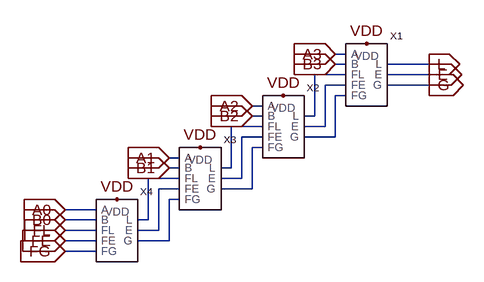
[diagram p0: schematic full-comparator4.asc]
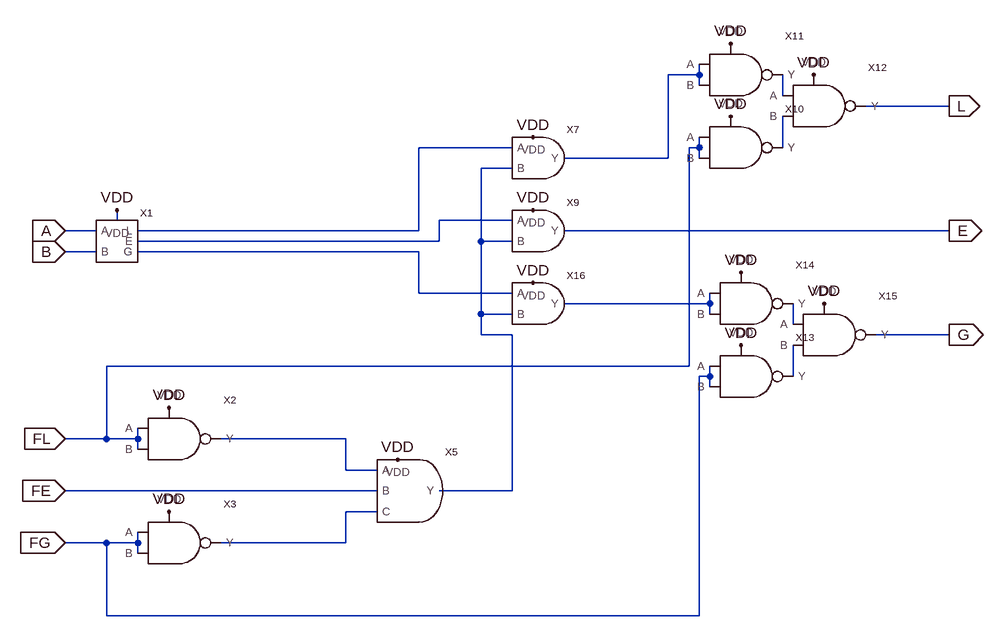
[diagram p1: sub-circuit full-comparator-sequential.asc]
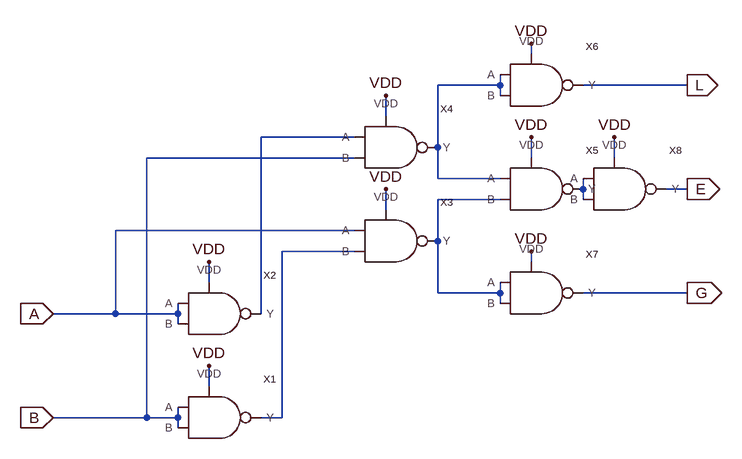
[diagram p2: sub-circuit full-comparator1.asc]
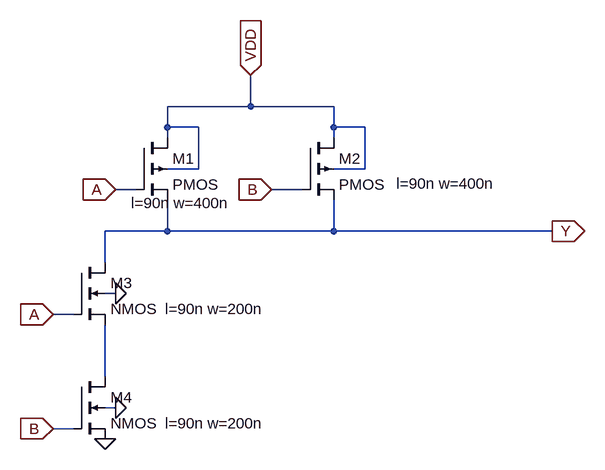
[diagram p3: sub-circuit nand.asc]
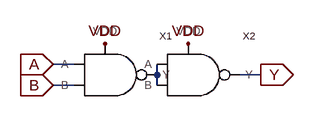
[diagram p4: sub-circuit and.asc]
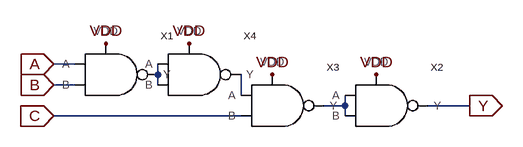
[diagram p5: sub-circuit and3.asc]
full-comparator4.asc, the LTspice schematic file:
Version 4
SHEET 1 1892 1292
WIRE 112 448 96 448
WIRE 112 464 96 464
WIRE 240 464 176 464
WIRE 112 480 64 480
WIRE 240 480 176 480
WIRE 112 496 80 496
WIRE 240 496 176 496
WIRE 112 512 96 512
WIRE -16 528 -32 528
WIRE -16 544 -32 544
WIRE 64 544 64 480
WIRE 64 544 48 544
WIRE -16 560 -64 560
WIRE 80 560 80 496
WIRE 80 560 48 560
WIRE -16 576 -48 576
WIRE 96 576 96 512
WIRE 96 576 48 576
WIRE -16 592 -32 592
WIRE -144 608 -160 608
WIRE -144 624 -160 624
WIRE -64 624 -64 560
WIRE -64 624 -80 624
WIRE -144 640 -192 640
WIRE -48 640 -48 576
WIRE -48 640 -80 640
WIRE -144 656 -176 656
WIRE -32 656 -32 592
WIRE -32 656 -80 656
WIRE -144 672 -160 672
WIRE -272 688 -320 688
WIRE -272 704 -320 704
WIRE -192 704 -192 640
WIRE -192 704 -208 704
WIRE -272 720 -320 720
WIRE -176 720 -176 656
WIRE -176 720 -208 720
WIRE -272 736 -320 736
WIRE -160 736 -160 672
WIRE -160 736 -208 736
WIRE -272 752 -320 752
FLAG -320 688 A0
IOPIN -320 688 In
FLAG -320 704 B0
IOPIN -320 704 In
FLAG -320 720 FL
IOPIN -320 720 In
FLAG -320 736 FE
IOPIN -320 736 In
FLAG -320 752 FG
IOPIN -320 752 In
FLAG -240 672 VDD
FLAG -112 592 VDD
FLAG 16 512 VDD
FLAG 144 432 VDD
FLAG 240 464 L
IOPIN 240 464 Out
FLAG 240 480 E
IOPIN 240 480 Out
FLAG 240 496 G
IOPIN 240 496 Out
FLAG -160 608 A1
IOPIN -160 608 In
FLAG -160 624 B1
IOPIN -160 624 In
FLAG -32 528 A2
IOPIN -32 528 In
FLAG -32 544 B2
IOPIN -32 544 In
FLAG 96 448 A3
IOPIN 96 448 In
FLAG 96 464 B3
IOPIN 96 464 In
SYMBOL full-comparator-sequential 144 480 R0
SYMATTR InstName X1
SYMBOL full-comparator-sequential 16 560 R0
SYMATTR InstName X2
SYMBOL full-comparator-sequential -112 640 R0
SYMATTR InstName X3
SYMBOL full-comparator-sequential -240 720 R0
SYMATTR InstName X4

full-comparator-sequential.asc, the sub-circuit schematic file:
Version 4
SHEET 1 880 680
WIRE 176 -176 176 -192
WIRE 176 -176 128 -176
WIRE 176 -160 176 -176
WIRE 304 -144 304 -176
WIRE 560 -128 432 -128
WIRE -112 -64 -256 -64
WIRE 176 -64 176 -80
WIRE 176 -64 160 -64
WIRE 304 -64 304 -112
WIRE 128 -48 128 -176
WIRE 128 -48 -32 -48
WIRE 176 -48 176 -64
WIRE -112 -32 -160 -32
WIRE -720 48 -720 32
WIRE -112 48 -224 48
WIRE -752 64 -800 64
WIRE -256 64 -256 -64
WIRE -256 64 -688 64
WIRE 560 64 -32 64
WIRE -224 80 -224 48
WIRE -224 80 -688 80
WIRE -160 80 -160 -32
WIRE -112 80 -160 80
WIRE -752 96 -800 96
WIRE -256 96 -688 96
WIRE -256 160 -256 96
WIRE -112 160 -256 160
WIRE 192 176 192 160
WIRE 192 176 -32 176
WIRE -160 192 -160 80
WIRE -112 192 -160 192
WIRE 192 192 192 176
WIRE 320 208 320 176
WIRE -160 224 -160 192
WIRE -112 224 -160 224
WIRE 560 224 448 224
WIRE 160 272 160 -64
WIRE 160 272 -736 272
WIRE 192 288 192 272
WIRE 192 288 176 288
WIRE 320 288 320 240
WIRE 192 304 192 288
WIRE -736 384 -736 272
WIRE -736 384 -800 384
WIRE -688 384 -688 368
WIRE -688 384 -736 384
WIRE -368 384 -560 384
WIRE -688 400 -688 384
WIRE -368 432 -368 384
WIRE -320 432 -368 432
WIRE -320 464 -800 464
WIRE -112 464 -112 224
WIRE -112 464 -224 464
WIRE -320 496 -368 496
WIRE -736 544 -800 544
WIRE -688 544 -688 528
WIRE -688 544 -736 544
WIRE -368 544 -368 496
WIRE -368 544 -560 544
WIRE -688 560 -688 544
WIRE -736 656 -736 544
WIRE 176 656 176 288
WIRE 176 656 -736 656
FLAG -800 64 A
IOPIN -800 64 In
FLAG -800 96 B
IOPIN -800 96 In
FLAG -720 32 VDD
FLAG -800 384 FL
IOPIN -800 384 In
FLAG -800 464 FE
IOPIN -800 464 In
FLAG -800 544 FG
IOPIN -800 544 In
FLAG 560 64 E
IOPIN 560 64 Out
FLAG 560 -128 L
IOPIN 560 -128 Out
FLAG 560 224 G
IOPIN 560 224 Out
FLAG -640 336 VDD
FLAG -640 496 VDD
FLAG 224 -224 VDD
FLAG 224 -112 VDD
FLAG 240 128 VDD
FLAG 240 240 VDD
FLAG 368 176 VDD
FLAG 352 -176 VDD
FLAG -80 144 VDD
FLAG -80 32 VDD
FLAG -80 -80 VDD
FLAG -288 416 VDD
SYMBOL full-comparator1 -720 80 R0
SYMATTR InstName X1
SYMBOL nand -640 384 R0
SYMATTR InstName X2
SYMBOL nand -640 544 R0
SYMATTR InstName X3
SYMBOL nand 224 -64 R0
SYMATTR InstName X10
SYMBOL nand 224 -176 R0
SYMATTR InstName X11
SYMBOL nand 352 -128 R0
SYMATTR InstName X12
SYMBOL nand 240 288 R0
SYMATTR InstName X13
SYMBOL nand 240 176 R0
SYMATTR InstName X14
SYMBOL nand 368 224 R0
SYMATTR InstName X15
SYMBOL and -80 -48 R0
SYMATTR InstName X7
SYMBOL and -80 64 R0
SYMATTR InstName X9
SYMBOL and -80 176 R0
SYMATTR InstName X16
SYMBOL and3 -288 464 R0
SYMATTR InstName X5

full-comparator1.asc, the sub-circuit schematic file:
Version 4
SHEET 1 880 680
WIRE 240 -320 240 -336
WIRE 192 -272 192 -288
WIRE 192 -272 96 -272
WIRE 480 -272 320 -272
WIRE 192 -256 192 -272
WIRE 16 -224 16 -256
WIRE -32 -192 -176 -192
WIRE 96 -176 96 -272
WIRE -32 -160 -352 -160
WIRE 240 -160 240 -192
WIRE 368 -160 368 -192
WIRE 96 -128 96 -176
WIRE 192 -128 96 -128
WIRE 320 -112 320 -128
WIRE 480 -112 448 -112
WIRE 192 -96 96 -96
WIRE 320 -96 320 -112
WIRE 16 -80 16 -112
WIRE -32 -48 -400 -48
WIRE 96 -32 96 -96
WIRE -32 -16 -144 -16
WIRE 240 0 240 -16
WIRE -256 32 -256 0
WIRE 96 48 96 -32
WIRE 192 48 192 32
WIRE 192 48 96 48
WIRE 480 48 320 48
WIRE 192 64 192 48
WIRE -400 80 -400 -48
WIRE -400 80 -496 80
WIRE -304 80 -304 64
WIRE -304 80 -400 80
WIRE -176 80 -176 -192
WIRE -304 96 -304 80
WIRE -256 192 -256 160
WIRE -352 240 -352 -160
WIRE -352 240 -496 240
WIRE -304 240 -304 224
WIRE -304 240 -352 240
WIRE -144 240 -144 -16
WIRE -144 240 -176 240
WIRE -304 256 -304 240
FLAG -496 240 B
IOPIN -496 240 In
FLAG -496 80 A
IOPIN -496 80 In
FLAG 480 -112 E
IOPIN 480 -112 Out
FLAG -256 160 VDD
FLAG -256 0 VDD
FLAG 16 -256 VDD
FLAG 16 -112 VDD
FLAG 240 -192 VDD
FLAG 480 48 G
IOPIN 480 48 Out
FLAG 480 -272 L
IOPIN 480 -272 Out
FLAG 240 -16 VDD
FLAG 240 -336 VDD
FLAG 368 -192 VDD
SYMBOL nand -256 240 R0
SYMATTR InstName X1
SYMBOL nand -256 80 R0
SYMATTR InstName X2
SYMBOL nand 16 -32 R0
SYMATTR InstName X3
SYMBOL nand 16 -176 R0
SYMATTR InstName X4
SYMBOL nand 240 -112 R0
SYMATTR InstName X5
SYMBOL nand 240 -272 R0
SYMATTR InstName X6
SYMBOL nand 240 48 R0
SYMATTR InstName X7
SYMBOL nand 368 -112 R0
SYMATTR InstName X8

nand.asc, the sub-circuit schematic file:
Version 4
SHEET 1 1436 680
WIRE 896 -896 896 -944
WIRE 896 -896 768 -896
WIRE 1024 -896 896 -896
WIRE 768 -864 768 -896
WIRE 816 -864 768 -864
WIRE 1024 -864 1024 -896
WIRE 1072 -864 1024 -864
WIRE 768 -848 768 -864
WIRE 1024 -848 1024 -864
WIRE 816 -800 816 -864
WIRE 816 -800 768 -800
WIRE 1072 -800 1072 -864
WIRE 1072 -800 1024 -800
WIRE 720 -768 688 -768
WIRE 976 -768 928 -768
WIRE 768 -704 768 -752
WIRE 768 -704 672 -704
WIRE 1024 -704 1024 -752
WIRE 1024 -704 768 -704
WIRE 1360 -704 1024 -704
WIRE 672 -656 672 -704
WIRE 688 -608 672 -608
WIRE 624 -576 592 -576
WIRE 672 -480 672 -560
WIRE 688 -432 672 -432
WIRE 624 -400 592 -400
FLAG 688 -768 A
IOPIN 688 -768 In
FLAG 592 -576 A
IOPIN 592 -576 In
FLAG 1360 -704 Y
IOPIN 1360 -704 Out
FLAG 896 -944 VDD
IOPIN 896 -944 In
FLAG 928 -768 B
IOPIN 928 -768 In
FLAG 592 -400 B
IOPIN 592 -400 In
FLAG 688 -608 0
FLAG 688 -432 0
FLAG 672 -384 0
SYMBOL pmos4 720 -848 R0
WINDOW 123 -8 101 Left 2
SYMATTR InstName M1
SYMATTR Value2 l=90n w=400n
SYMBOL pmos4 976 -848 R0
WINDOW 123 144 71 Left 2
SYMATTR InstName M2
SYMATTR Value2 l=90n w=400n
SYMBOL nmos4 624 -656 R0
WINDOW 123 140 72 Left 2
SYMATTR InstName M3
SYMATTR Value2 l=90n w=200n
SYMBOL nmos4 624 -480 R0
WINDOW 123 140 72 Left 2
SYMATTR InstName M4
SYMATTR Value2 l=90n w=200n

and.asc, the sub-circuit schematic file:
Version 4
SHEET 1 880 680
WIRE 112 128 80 128
WIRE 240 144 240 128
WIRE 400 144 368 144
WIRE 112 160 80 160
WIRE 240 160 240 144
FLAG 80 128 A
IOPIN 80 128 In
FLAG 80 160 B
IOPIN 80 160 In
FLAG 400 144 Y
IOPIN 400 144 Out
FLAG 160 96 VDD
FLAG 288 96 VDD
SYMBOL nand 160 144 R0
SYMATTR InstName X1
SYMBOL nand 288 144 R0
SYMATTR InstName X2

and3.asc, the sub-circuit schematic file:
Version 4
SHEET 1 880 680
WIRE 144 144 112 144
WIRE 272 160 272 144
WIRE 144 176 112 176
WIRE 272 176 272 160
WIRE 400 192 400 160
WIRE 560 208 560 192
WIRE 560 208 528 208
WIRE 752 208 688 208
WIRE 400 224 112 224
WIRE 560 224 560 208
FLAG 112 144 A
IOPIN 112 144 In
FLAG 192 112 VDD
FLAG 448 160 VDD
FLAG 320 112 VDD
FLAG 112 176 B
IOPIN 112 176 In
FLAG 112 224 C
IOPIN 112 224 In
FLAG 608 160 VDD
FLAG 752 208 Y
IOPIN 752 208 Out
SYMBOL nand 192 160 R0
SYMATTR InstName X1
SYMBOL nand 448 208 R0
SYMATTR InstName X3
SYMBOL nand 320 160 R0
SYMATTR InstName X4
SYMBOL nand 608 208 R0
SYMATTR InstName X2

The netlist it stands for:
* full-comparator4.asc
XX1 A3 B3 N001 N002 N003 VDD L E G full-comparator-sequential
XX2 A2 B2 N004 N005 N006 VDD N001 N002 N003 full-comparator-sequential
XX3 A1 B1 N007 N008 N009 VDD N004 N005 N006 full-comparator-sequential
XX4 A0 B0 FL FE FG VDD N007 N008 N009 full-comparator-sequential

* block symbol definitions
.subckt full-comparator-sequential A B FL FE FG VDD L E G
XX1 A B VDD N003 N006 N007 full-comparator1
XX2 FL FL VDD N011 nand
XX3 FG FG VDD N012 nand
XX10 FL FL VDD N004 nand
XX11 N001 N001 VDD N002 nand
XX12 N002 N004 VDD L nand
XX13 FG FG VDD N010 nand
XX14 N008 N008 VDD N009 nand
XX15 N009 N010 VDD G nand
XX7 N003 N005 VDD N001 and
XX9 N006 N005 VDD E and
XX16 N007 N005 VDD N008 and
XX5 N011 FE N012 VDD N005 and3
.ends full-comparator-sequential

.subckt full-comparator1 A B VDD L E G
XX1 B B VDD N005 nand
XX2 A A VDD N002 nand
XX3 A N005 VDD N004 nand
XX4 N002 B VDD N001 nand
XX5 N001 N004 VDD N003 nand
XX6 N001 N001 VDD L nand
XX7 N004 N004 VDD G nand
XX8 N003 N003 VDD E nand
.ends full-comparator1

.subckt nand A B VDD Y
M1 VDD A Y VDD PMOS l=90n w=400n
M2 VDD B Y VDD PMOS l=90n w=400n
M3 Y A N001 0 NMOS l=90n w=200n
M4 N001 B 0 0 NMOS l=90n w=200n
.ends nand

.subckt and A B VDD Y
XX1 A B VDD N001 nand
XX2 N001 N001 VDD Y nand
.ends and

.subckt and3 A B C VDD Y
XX1 A B VDD N001 nand
XX3 N002 C VDD N003 nand
XX4 N001 N001 VDD N002 nand
XX2 N003 N003 VDD Y nand
.ends and3

.model NMOS NMOS
.model PMOS PMOS
.lib standard.mos
.backanno
.end